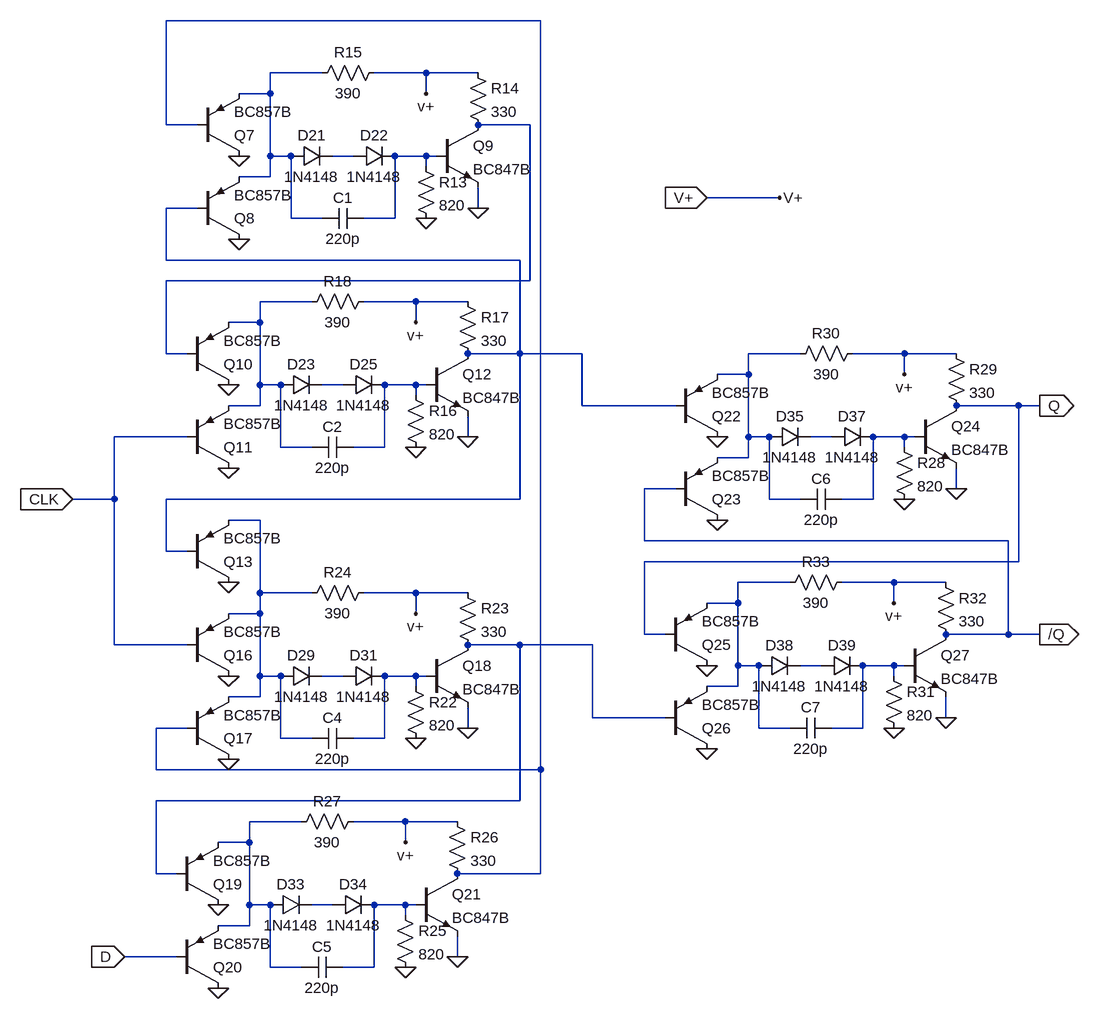
[diagram p0: schematic D-FlipFlop-Edge-MT15.asc]
D-FlipFlop-Edge-MT15.asc, the LTspice schematic file:
Version 4
SHEET 1 4684 1036
WIRE 3840 -864 3264 -864
WIRE 3504 -784 3424 -784
WIRE 3664 -784 3584 -784
WIRE 3744 -784 3664 -784
WIRE 3424 -752 3424 -784
WIRE 3424 -752 3376 -752
WIRE 3664 -752 3664 -784
WIRE 3264 -704 3264 -864
WIRE 3312 -704 3264 -704
WIRE 3824 -704 3744 -704
WIRE 3424 -656 3424 -752
WIRE 3456 -656 3424 -656
WIRE 3552 -656 3520 -656
WIRE 3664 -656 3616 -656
WIRE 3680 -656 3664 -656
WIRE 3664 -640 3664 -656
WIRE 3424 -624 3424 -656
WIRE 3424 -624 3376 -624
WIRE 4208 -592 4096 -592
WIRE 3312 -576 3264 -576
WIRE 3744 -576 3744 -608
WIRE 3456 -560 3456 -656
WIRE 3504 -560 3456 -560
WIRE 3616 -560 3616 -656
WIRE 3616 -560 3568 -560
WIRE 3264 -496 3264 -576
WIRE 3808 -496 3264 -496
WIRE 3824 -464 3824 -704
WIRE 3824 -464 3264 -464
WIRE 3488 -432 3408 -432
WIRE 3648 -432 3568 -432
WIRE 3728 -432 3648 -432
WIRE 3408 -400 3408 -432
WIRE 3408 -400 3360 -400
WIRE 3648 -400 3648 -432
WIRE 3264 -352 3264 -464
WIRE 3296 -352 3264 -352
WIRE 3808 -352 3808 -496
WIRE 3808 -352 3728 -352
WIRE 3904 -352 3808 -352
WIRE 4240 -352 4160 -352
WIRE 4400 -352 4320 -352
WIRE 4480 -352 4400 -352
WIRE 4160 -320 4160 -352
WIRE 4160 -320 4112 -320
WIRE 4400 -320 4400 -352
WIRE 3408 -304 3408 -400
WIRE 3440 -304 3408 -304
WIRE 3536 -304 3504 -304
WIRE 3648 -304 3600 -304
WIRE 3664 -304 3648 -304
WIRE 3648 -288 3648 -304
WIRE 3408 -272 3408 -304
WIRE 3408 -272 3360 -272
WIRE 3904 -272 3904 -352
WIRE 4048 -272 3904 -272
WIRE 4576 -272 4480 -272
WIRE 4608 -272 4576 -272
WIRE 3296 -224 3184 -224
WIRE 3728 -224 3728 -256
WIRE 4160 -224 4160 -320
WIRE 4192 -224 4160 -224
WIRE 4288 -224 4256 -224
WIRE 4400 -224 4352 -224
WIRE 4416 -224 4400 -224
WIRE 3440 -208 3440 -304
WIRE 3488 -208 3440 -208
WIRE 3600 -208 3600 -304
WIRE 3600 -208 3552 -208
WIRE 4400 -208 4400 -224
WIRE 4160 -192 4160 -224
WIRE 4160 -192 4112 -192
WIRE 4048 -144 4000 -144
WIRE 4480 -144 4480 -176
WIRE 3184 -128 3184 -224
WIRE 3184 -128 3120 -128
WIRE 3808 -128 3808 -352
WIRE 3808 -128 3264 -128
WIRE 4192 -128 4192 -224
WIRE 4240 -128 4192 -128
WIRE 4352 -128 4352 -224
WIRE 4352 -128 4304 -128
WIRE 3408 -96 3360 -96
WIRE 4000 -64 4000 -144
WIRE 4560 -64 4000 -64
WIRE 3264 -48 3264 -128
WIRE 3296 -48 3264 -48
WIRE 4576 -32 4576 -272
WIRE 4576 -32 4000 -32
WIRE 4224 0 4144 0
WIRE 4384 0 4304 0
WIRE 4464 0 4384 0
WIRE 3408 16 3408 -96
WIRE 3488 16 3408 16
WIRE 3648 16 3568 16
WIRE 3728 16 3648 16
WIRE 4144 32 4144 0
WIRE 4144 32 4096 32
WIRE 4384 32 4384 0
WIRE 3408 48 3408 16
WIRE 3408 48 3360 48
WIRE 3648 48 3648 16
WIRE 4000 80 4000 -32
WIRE 4032 80 4000 80
WIRE 4560 80 4560 -64
WIRE 4560 80 4464 80
WIRE 4608 80 4560 80
WIRE 3184 96 3184 -128
WIRE 3296 96 3184 96
WIRE 3808 96 3728 96
WIRE 3920 96 3808 96
WIRE 4144 128 4144 32
WIRE 4176 128 4144 128
WIRE 4272 128 4240 128
WIRE 4384 128 4336 128
WIRE 4400 128 4384 128
WIRE 3408 144 3408 48
WIRE 3440 144 3408 144
WIRE 3536 144 3504 144
WIRE 3648 144 3600 144
WIRE 3664 144 3648 144
WIRE 4384 144 4384 128
WIRE 3648 160 3648 144
WIRE 4144 160 4144 128
WIRE 4144 160 4096 160
WIRE 3408 176 3408 144
WIRE 3408 176 3360 176
WIRE 3920 208 3920 96
WIRE 4032 208 3920 208
WIRE 4464 208 4464 176
WIRE 3296 224 3248 224
WIRE 3728 224 3728 192
WIRE 4176 224 4176 128
WIRE 4224 224 4176 224
WIRE 4336 224 4336 128
WIRE 4336 224 4288 224
WIRE 3440 240 3440 144
WIRE 3488 240 3440 240
WIRE 3600 240 3600 144
WIRE 3600 240 3552 240
WIRE 3248 288 3248 224
WIRE 3840 288 3840 -864
WIRE 3840 288 3248 288
WIRE 3808 336 3808 96
WIRE 3808 336 3248 336
WIRE 3472 368 3392 368
WIRE 3632 368 3552 368
WIRE 3712 368 3632 368
WIRE 3392 400 3392 368
WIRE 3392 400 3344 400
WIRE 3632 400 3632 368
WIRE 3248 448 3248 336
WIRE 3280 448 3248 448
WIRE 3840 448 3840 288
WIRE 3840 448 3712 448
WIRE 3392 496 3392 400
WIRE 3424 496 3392 496
WIRE 3520 496 3488 496
WIRE 3632 496 3584 496
WIRE 3648 496 3632 496
WIRE 3632 512 3632 496
WIRE 3392 528 3392 496
WIRE 3392 528 3344 528
WIRE 3280 576 3200 576
WIRE 3712 576 3712 544
WIRE 3424 592 3424 496
WIRE 3472 592 3424 592
WIRE 3584 592 3584 496
WIRE 3584 592 3536 592
FLAG 3120 -128 CLK
IOPIN 3120 -128 In
FLAG 3200 576 D
IOPIN 3200 576 In
FLAG 4608 -272 Q
IOPIN 4608 -272 Out
FLAG 4608 80 /Q
IOPIN 4608 80 Out
FLAG 4208 -592 V+
FLAG 4096 -592 V+
IOPIN 4096 -592 In
FLAG 3648 240 0
FLAG 3728 224 0
FLAG 3360 144 0
FLAG 3360 272 0
FLAG 3648 48 v+
FLAG 3632 592 0
FLAG 3712 576 0
FLAG 3344 496 0
FLAG 3344 624 0
FLAG 3632 400 v+
FLAG 4400 -128 0
FLAG 4480 -144 0
FLAG 4112 -224 0
FLAG 4112 -96 0
FLAG 4400 -320 v+
FLAG 4384 224 0
FLAG 4464 208 0
FLAG 4096 128 0
FLAG 4096 256 0
FLAG 4384 32 v+
FLAG 3664 -560 0
FLAG 3744 -576 0
FLAG 3376 -656 0
FLAG 3376 -528 0
FLAG 3664 -752 v+
FLAG 3648 -208 0
FLAG 3728 -224 0
FLAG 3360 -304 0
FLAG 3360 -176 0
FLAG 3648 -400 v+
FLAG 3360 0 0
SYMBOL pnp 3296 144 M180
SYMATTR InstName Q16
SYMATTR Value BC857B
SYMBOL pnp 3296 272 M180
SYMATTR InstName Q17
SYMATTR Value BC857B
SYMBOL npn 3664 96 R0
SYMATTR InstName Q18
SYMATTR Value BC847B
SYMBOL diode 3440 128 M90
WINDOW 0 0 32 VBottom 2
WINDOW 3 32 32 VTop 2
SYMATTR InstName D29
SYMATTR Value 1N4148
SYMBOL diode 3536 128 M90
WINDOW 0 0 32 VBottom 2
WINDOW 3 32 32 VTop 2
SYMATTR InstName D31
SYMATTR Value 1N4148
SYMBOL cap 3552 224 R90
WINDOW 0 0 32 VBottom 2
WINDOW 3 32 32 VTop 2
SYMATTR InstName C4
SYMATTR Value 220p
SYMBOL res 3632 144 R0
SYMATTR InstName R22
SYMATTR Value 820
SYMBOL res 3712 0 R0
SYMATTR InstName R23
SYMATTR Value 330
SYMBOL res 3584 0 R90
WINDOW 0 0 56 VBottom 2
WINDOW 3 32 56 VTop 2
SYMATTR InstName R24
SYMATTR Value 390
SYMBOL pnp 3280 496 M180
SYMATTR InstName Q19
SYMATTR Value BC857B
SYMBOL pnp 3280 624 M180
SYMATTR InstName Q20
SYMATTR Value BC857B
SYMBOL npn 3648 448 R0
SYMATTR InstName Q21
SYMATTR Value BC847B
SYMBOL diode 3424 480 M90
WINDOW 0 0 32 VBottom 2
WINDOW 3 32 32 VTop 2
SYMATTR InstName D33
SYMATTR Value 1N4148
SYMBOL diode 3520 480 M90
WINDOW 0 0 32 VBottom 2
WINDOW 3 32 32 VTop 2
SYMATTR InstName D34
SYMATTR Value 1N4148
SYMBOL cap 3536 576 R90
WINDOW 0 0 32 VBottom 2
WINDOW 3 32 32 VTop 2
SYMATTR InstName C5
SYMATTR Value 220p
SYMBOL res 3616 496 R0
SYMATTR InstName R25
SYMATTR Value 820
SYMBOL res 3696 352 R0
SYMATTR InstName R26
SYMATTR Value 330
SYMBOL res 3568 352 R90
WINDOW 0 0 56 VBottom 2
WINDOW 3 32 56 VTop 2
SYMATTR InstName R27
SYMATTR Value 390
SYMBOL pnp 4048 -224 M180
SYMATTR InstName Q22
SYMATTR Value BC857B
SYMBOL pnp 4048 -96 M180
SYMATTR InstName Q23
SYMATTR Value BC857B
SYMBOL npn 4416 -272 R0
SYMATTR InstName Q24
SYMATTR Value BC847B
SYMBOL diode 4192 -240 M90
WINDOW 0 0 32 VBottom 2
WINDOW 3 32 32 VTop 2
SYMATTR InstName D35
SYMATTR Value 1N4148
SYMBOL diode 4288 -240 M90
WINDOW 0 0 32 VBottom 2
WINDOW 3 32 32 VTop 2
SYMATTR InstName D37
SYMATTR Value 1N4148
SYMBOL cap 4304 -144 R90
WINDOW 0 0 32 VBottom 2
WINDOW 3 32 32 VTop 2
SYMATTR InstName C6
SYMATTR Value 220p
SYMBOL res 4384 -224 R0
SYMATTR InstName R28
SYMATTR Value 820
SYMBOL res 4464 -368 R0
SYMATTR InstName R29
SYMATTR Value 330
SYMBOL res 4336 -368 R90
WINDOW 0 0 56 VBottom 2
WINDOW 3 32 56 VTop 2
SYMATTR InstName R30
SYMATTR Value 390
SYMBOL pnp 4032 128 M180
SYMATTR InstName Q25
SYMATTR Value BC857B
SYMBOL pnp 4032 256 M180
SYMATTR InstName Q26
SYMATTR Value BC857B
SYMBOL npn 4400 80 R0
SYMATTR InstName Q27
SYMATTR Value BC847B
SYMBOL diode 4176 112 M90
WINDOW 0 0 32 VBottom 2
WINDOW 3 32 32 VTop 2
SYMATTR InstName D38
SYMATTR Value 1N4148
SYMBOL diode 4272 112 M90
WINDOW 0 0 32 VBottom 2
WINDOW 3 32 32 VTop 2
SYMATTR InstName D39
SYMATTR Value 1N4148
SYMBOL cap 4288 208 R90
WINDOW 0 0 32 VBottom 2
WINDOW 3 32 32 VTop 2
SYMATTR InstName C7
SYMATTR Value 220p
SYMBOL res 4368 128 R0
SYMATTR InstName R31
SYMATTR Value 820
SYMBOL res 4448 -16 R0
SYMATTR InstName R32
SYMATTR Value 330
SYMBOL res 4320 -16 R90
WINDOW 0 0 56 VBottom 2
WINDOW 3 32 56 VTop 2
SYMATTR InstName R33
SYMATTR Value 390
SYMBOL pnp 3312 -656 M180
SYMATTR InstName Q7
SYMATTR Value BC857B
SYMBOL pnp 3312 -528 M180
SYMATTR InstName Q8
SYMATTR Value BC857B
SYMBOL npn 3680 -704 R0
SYMATTR InstName Q9
SYMATTR Value BC847B
SYMBOL diode 3456 -672 M90
WINDOW 0 0 32 VBottom 2
WINDOW 3 32 32 VTop 2
SYMATTR InstName D21
SYMATTR Value 1N4148
SYMBOL diode 3552 -672 M90
WINDOW 0 0 32 VBottom 2
WINDOW 3 32 32 VTop 2
SYMATTR InstName D22
SYMATTR Value 1N4148
SYMBOL cap 3568 -576 R90
WINDOW 0 0 32 VBottom 2
WINDOW 3 32 32 VTop 2
SYMATTR InstName C1
SYMATTR Value 220p
SYMBOL res 3648 -656 R0
SYMATTR InstName R13
SYMATTR Value 820
SYMBOL res 3728 -800 R0
SYMATTR InstName R14
SYMATTR Value 330
SYMBOL res 3600 -800 R90
WINDOW 0 0 56 VBottom 2
WINDOW 3 32 56 VTop 2
SYMATTR InstName R15
SYMATTR Value 390
SYMBOL pnp 3296 -304 M180
SYMATTR InstName Q10
SYMATTR Value BC857B
SYMBOL pnp 3296 -176 M180
SYMATTR InstName Q11
SYMATTR Value BC857B
SYMBOL npn 3664 -352 R0
SYMATTR InstName Q12
SYMATTR Value BC847B
SYMBOL diode 3440 -320 M90
WINDOW 0 0 32 VBottom 2
WINDOW 3 32 32 VTop 2
SYMATTR InstName D23
SYMATTR Value 1N4148
SYMBOL diode 3536 -320 M90
WINDOW 0 0 32 VBottom 2
WINDOW 3 32 32 VTop 2
SYMATTR InstName D25
SYMATTR Value 1N4148
SYMBOL cap 3552 -224 R90
WINDOW 0 0 32 VBottom 2
WINDOW 3 32 32 VTop 2
SYMATTR InstName C2
SYMATTR Value 220p
SYMBOL res 3632 -304 R0
SYMATTR InstName R16
SYMATTR Value 820
SYMBOL res 3712 -448 R0
SYMATTR InstName R17
SYMATTR Value 330
SYMBOL res 3584 -448 R90
WINDOW 0 0 56 VBottom 2
WINDOW 3 32 56 VTop 2
SYMATTR InstName R18
SYMATTR Value 390
SYMBOL pnp 3296 0 M180
SYMATTR InstName Q13
SYMATTR Value BC857B

The netlist it stands for:
* D-FlipFlop-Edge-MT15.asc
Q16 0 CLK N013 0 BC857B
Q17 0 N001 N013 0 BC857B
Q18 N015 N019 0 0 BC847B
D29 N013 N018 1N4148
D31 N018 N019 1N4148
C4 N019 N013 220p
R22 N019 0 820
R23 V+ N015 330
R24 V+ N013 390
Q19 0 N015 N020 0 BC857B
Q20 0 D N020 0 BC857B
Q21 N001 N022 0 0 BC847B
D33 N020 N021 1N4148
D34 N021 N022 1N4148
C5 N022 N020 220p
R25 N022 0 820
R26 V+ N001 330
R27 V+ N020 390
Q22 0 N006 N008 0 BC857B
Q23 0 /Q N008 0 BC857B
Q24 Q N012 0 0 BC847B
D35 N008 N011 1N4148
D37 N011 N012 1N4148
C6 N012 N008 220p
R28 N012 0 820
R29 V+ Q 330
R30 V+ N008 390
Q25 0 Q N014 0 BC857B
Q26 0 N015 N014 0 BC857B
Q27 /Q N017 0 0 BC847B
D38 N014 N016 1N4148
D39 N016 N017 1N4148
C7 N017 N014 220p
R31 N017 0 820
R32 V+ /Q 330
R33 V+ N014 390
Q7 0 N001 N002 0 BC857B
Q8 0 N006 N002 0 BC857B
Q9 N003 N005 0 0 BC847B
D21 N002 N004 1N4148
D22 N004 N005 1N4148
C1 N005 N002 220p
R13 N005 0 820
R14 V+ N003 330
R15 V+ N002 390
Q10 0 N003 N007 0 BC857B
Q11 0 CLK N007 0 BC857B
Q12 N006 N010 0 0 BC847B
D23 N007 N009 1N4148
D25 N009 N010 1N4148
C2 N010 N007 220p
R16 N010 0 820
R17 V+ N006 330
R18 V+ N007 390
Q13 0 N006 N013 0 BC857B
.model D D
.lib standard.dio
.model NPN NPN
.model PNP PNP
.lib standard.bjt
.backanno
.end